# EAGLE design Zigbee Tracker v2 Mainboard (EAGLE 9.5.0)
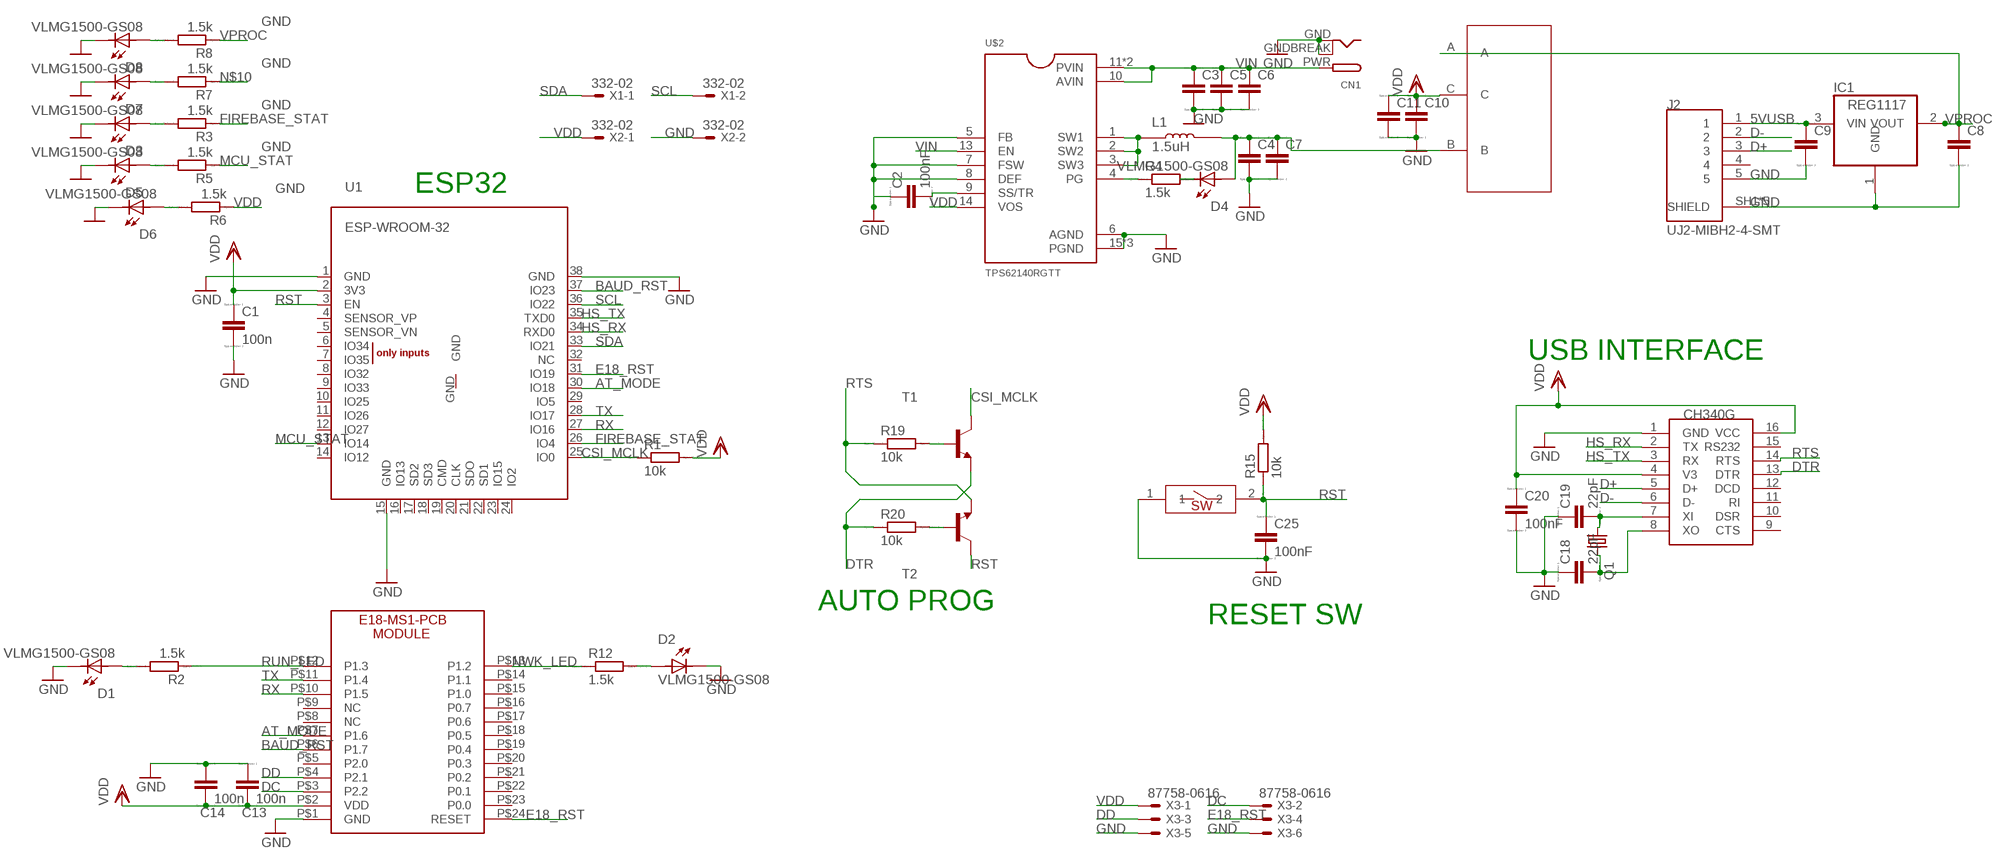
[diagram p0: schematic, sheet 1]

## Parts
C1  100n  CC0603  [C0603]
C2  100nF  CC0402  [C0402]
C3  CC0402  [C0402]
C4  CC0402  [C0402]
C5  CC1210  [C1210]
C6  CC1210  [C1210]
C7  CC1210  [C1210]
C8  CC0603  [C0603]
C9  CC0603  [C0603]
C10  CC1210  [C1210]
C11  CC1210  [C1210]
C13  100n  CC0603  [C0603]
C14  100n  CC0603  [C0603]
C18  22pF  CC0402  [C0402]
C19  22pF  CC0402  [C0402]
C20  100nF  CC0603  [C0603]
C25  100nF  CC0402  [C0402]
CN1  DCBARRELPTH  [DCJACK_2MM_PTH]
D1  VLMG1500-GS08  [LEDC1005X35N]
D2  VLMG1500-GS08  [LEDC1005X35N]
D3  VLMG1500-GS08  [LEDC1005X35N]
D4  VLMG1500-GS08  [LEDC1005X35N]
D5  VLMG1500-GS08  [LEDC1005X35N]
D6  VLMG1500-GS08  [LEDC1005X35N]
D7  VLMG1500-GS08  [LEDC1005X35N]
D8  VLMG1500-GS08  [LEDC1005X35N]
IC1  REG1117  [SOT223]
J2  UJ2-MIBH2-4-SMT  [CUI_UJ2-MIBH2-4-SMT]
L1  1.5uH  DFE252012F-100M=P2  [INDC2520X120N]
Q1  KX-7  [3.2X2.5_KX-7]
R1  10k  RR0402  [R0402]
R2  1.5k  RR0402  [R0402]
R3  1.5k  RR0402  [R0402]
R4  1.5k  RR0402  [R0402]
R5  1.5k  RR0402  [R0402]
R6  1.5k  RR0402  [R0402]
R7  1.5k  RR0402  [R0402]
R8  1.5k  RR0402  [R0402]
R12  1.5k  RR0402  [R0402]
R15  10k  RR0402  [R0402]
R19  10k  RR0402  [R0402]
R20  10k  RR0402  [R0402]
RESET  SMDSWITCH  [RESC4217X170]
T1  -NPN-SOT23-BEC  [SOT23-BEC]
T2  -NPN-SOT23-BEC  [SOT23-BEC]
U1  ESP-WROOM-32  [ESP-WROOM-32]
U5  H  CH340G  [SOIC16]
U$1  E18  [E18-MS1-PCB]
U$2  TPS62140RGTT  [QFN50P300X300X100-17N]
U$3  SMDTOGGLESWITCH  [SMDTOGGLESWITCH]
X1  332-02  [332-02]
X2  332-02  [332-02]
X3  87758-0616  [87758-0616]

## Nets
5VUSB [PWRINFL]: C9.1 IC1.3(VIN) J2.1
AT_MODE: U1.30(IO18) U$1.P$7(P1.6)
BAUD_RST: U1.37(IO23) U$1.P$6(P1.7)
CSI_MCLK: R1.1 T1.C U1.25(IO0)
D+: J2.3 U5.5(D+)
D-: J2.2 U5.6(D-)
DC: U$1.P$3(P2.2) X3.2
DD: U$1.P$4(P2.1) X3.3
DTR: R20.1 T1.E U5.13(DTR)
E18_RST: U1.31(IO19) U$1.P$24(RESET) X3.4
FIREBASE_STAT: R3.1 U1.26(IO4)
GND: C1.2 C2.1 C3.2 C4.2 C5.2 C6.2 C7.2 C8.2 C9.2 C10.2 C11.2 C13.1 C14.1 C18.1 C19.1 C20.2 C25.2 CN1.GND CN1.GNDBREAK D1.2 D2.2 D3.2 D5.2 D6.2 D7.2 D8.2 IC1.1(GND) J2.5 J2.SH1(SHIELD) J2.SH2(SHIELD) J2.SH3(SHIELD) J2.SH4(SHIELD) J2.SH5(SHIELD) RESET.1 U1.1(GND) U1.15(GND) U1.38(GND) U5.1(GND) U$1.P$1(GND) U$2.5(FB) U$2.6(AGND) U$2.7(FSW) U$2.8(DEF) U$2.15(PGND) U$2.16(PGND) U$2.TH(PGND) X2.2 X3.5 X3.6
HS_RX: U1.34(RXD0) U5.2(TX)
HS_TX: U1.35(TXD0) U5.3(RX)
MCU_STAT: R5.1 U1.13(IO14)
N$1: L1.1 U$2.1(SW1) U$2.2(SW2) U$2.3(SW3)
N$2: C2.2 U$2.9(SS/TR)
N$3: R19.2 T1.B
N$4: D1.1 R2.2
N$5: C18.2 Q1.3 U5.8(XO)
N$6: R20.2 T2.B
N$7: D3.1 R3.2
N$8: D4.2 R4.2
N$9: C19.2 Q1.1 U5.7(XI)
N$10: C4.1 C7.1 D4.1 L1.2 R7.1 U$3.B
N$11: D2.1 R12.2
N$12: R4.1 U$2.4(PG)
N$13: D5.1 R5.2
N$14: D6.1 R6.2
N$15: D7.1 R7.2
N$16: D8.1 R8.2
NWK_LED: R12.1 U$1.P$13(P1.2)
RST: C25.1 R15.1 RESET.2 T2.C U1.3(EN)
RTS: R19.1 T2.E U5.14(RTS)
RUN_LED: R2.1 U$1.P$12(P1.3)
RX: U1.27(IO16) U$1.P$10(P1.5)
SCL: U1.36(IO22) X1.2
SDA: U1.33(IO21) X1.1
TX: U1.28(IO17) U$1.P$11(P1.4)
VDD: C1.1 C10.1 C11.1 C13.2 C14.2 C20.1 R1.2 R6.1 R15.2 U1.2(3V3) U5.4(V3) U5.16(VCC) U$1.P$2(VDD) U$2.14(VOS) U$3.C X2.1 X3.1
VIN: C3.1 C5.1 C6.1 CN1.PWR U$2.10(AVIN) U$2.11(PVIN) U$2.12(PVIN) U$2.13(EN)
VPROC: C8.1 IC1.2(VOUT) R8.1 U$3.A
Unconnected: J2.4 U1.4(SENSOR_VP) U1.5(SENSOR_VN) U1.6(IO34) U1.7(IO35) U1.8(IO32) U1.9(IO33) U1.10(IO25) U1.11(IO26) U1.12(IO27) U1.14(IO12) U1.16(IO13) U1.17(SD2) U1.18(SD3) U1.19(CMD) U1.20(CLK) U1.21(SDO) U1.22(SD1) U1.23(IO15) U1.24(IO2) U1.29(IO5) U1.32(NC) U1.GND U5.9(CTS) U5.10(DSR) U5.11(RI) U5.12(DCD) U5.15(RS232) U$1.P$5(P2.0) U$1.P$8(NC) U$1.P$9(NC) U$1.P$14(P1.1) U$1.P$15(P1.0) U$1.P$16(P0.7) U$1.P$17(P0.6) U$1.P$18(P0.5) U$1.P$19(P0.4) U$1.P$20(P0.3) U$1.P$21(P0.2) U$1.P$22(P0.1) U$1.P$23(P0.0)

## Notes on the sheet
- ESP32
- USB INTERFACE
- AUTO PROG
- RESET SW

## Library data of the parts
C1-C11 C13 C14 C18-C20 C25 = eagle-ltspice:C: CAPACITOR, European symbol; SPICEMODEL: NONE; SPICEPREFIX: C
CN1 = adafruit:DCBARREL: 2.0mm DC Barrel Jack DCJACK_2MM_PTH - Through Hole Jack (4UConnector: 05537)
D1-D8 = VLMG1500-GS08:VLMG1500-GS08: 0402 GREEN 571nm 35MCD 65° Rectangle with Flat Top SMT LED; AVAILABILITY: Unavailable; DESCRIPTION: 0402 GREEN 571nm 35MCD 65° Rectangle with Flat Top SMT LED; MF: Vishay; MP: VLMG1500-GS08; PACKAGE: 0402 Vishay; PRICE: None
IC1 = burr-brown:REG1117: 800mA and 1A Low Dropout (LDO) Positive Regulator 1.8V, 2.5V, 2.85V, 3.3V, 5V, and Adj; MPN: REG1117; OC_FARNELL: 1097566; OC_NEWARK: 14P6981
J2 = UJ2-MIBH2-4-SMT:UJ2-MIBH2-4-SMT: Micro B, USB 2.0, 1.8 A, Right Angle, Surface Mount (SMT), USB Receptacle; AVAILABILITY: Unavailable; CUI_PURCHASE_URL: https://www.cui.com/product/interconnect/connectors/usb-connectors/uj2-mibh2-4-smt?utm_source=snapeda.com&utm_medium=referral&utm_campaign=snapedaBOM; DESCRIPTION: Micro B, USB 2.0, 1.8 A, Right Angle, Surface Mount _SMT_, USB Receptacle; MF: CUI Inc.; MP: UJ2-MIBH2-4-SMT; PACKAGE: None; PRICE: None
L1 = DFE252012F-100M_P2:DFE252012F-100M=P2: Inductor Power Chip Shielded Multi-Layer 10uH 20% 1MHz Metal 900mA 480mOhm DCR 1008 T/R; AVAILABILITY: Unavailable; DESCRIPTION: Inductor Power Chip Shielded Multi-Layer 10uH 20% 1MHz Metal 900mA 480mOhm DCR 1008 T/R; MF: Murata Electronics; MP: DFE252012F-100M=P2; PACKAGE: 1008 Murata; PRICE: None
Q1 = crystal-geyer_V1_0:KX: Quartz Crystals (MHz) SMD: KX - Serie Model Size l/w/h [mm] Frequency Range Frequency Stability Temp. Range [°C] Load Capacitance AECQ 200 availabel Datasheet KX-4 KX-5 KX-6 KX-7 KX-9A KX-9B KX-12A KX-12B KX-13 KX-20 KX-K KX-KS 1.6/1.2/0.3 2.0/1.6/0.45 2.5/2.0/0.55 3.2/2.5/0.8 5.0/3.2/1.0 5.0/3.2/1.1 6.0/3.5/1.1 6.0/3.5/1.0 7.0/5.0 /1.3 11.6/5.5/1.6 12.3/4.5/4.2 12.3/4.5/3.2 24.0 ~ 80.0 MHz 16.0 ~ 80.0 MHz 12.0 ~ 80.0 MHz 8.0 ~ 60.0 MHz 7,68 ~ 300,0 MHz 8,0 ~ 50,0 MHz 8,0 ~ 150,0 MHz 8,0 ~ 50,0 MHz 6,0 ~ 160,0 MHz 3,579 ~ 25,0 MHz 3,579 ~ 70,0 MHz 3,579 ~ 70,0 MHz ±10 … ±50ppm ±10 … ±50ppm ±10 … ±50ppm ±10 … ±50ppm ±10 … ±50ppm ±10 … ±50ppm ±10 … ±50ppm ±10 … ±50ppm ±10 … ±50ppm ±50ppm ±10 … ±50ppm ±10 … ±50ppm (*) -40°C …+85°C (*) -40°C …+125°C (*) -40°C …+125°C (*) -40°C …+125°C (*) -40°C …+105°C (*) -40°C …+105°C (*) -40°C …+125°C (*) -40°C …+105°C (*) -40°C …+105°C (*) -40°C …+105°C (*) -40°C …+85°C (*) -40°C …+85°C 8, 8…16 8, 8…16 10, 8…16 12, 7…20 16, 10…20 16, 10…20 16, 10…20 16, 12…20 16, 12…20 16, 12…20 16, 12…30 16, 12…30 - yes yes yes - - - - - - - - KX-4.pdf <http://www.geyer-electronic.de/uploads/tx_userartikelfrequenz/GEYER-KX-4.pdf> KX-5.pdf <http://www.geyer-electronic.de/uploads/tx_userartikelfrequenz/GEYER-KX-5.pdf> KX-6.pdf <http://www.geyer-electronic.de/uploads/tx_userartikelfrequenz/GEYER-KX-6.pdf> KX-7.pdf <http://www.geyer-electronic.de/uploads/tx_userartikelfrequenz/GEYER-KX-7.pdf> KX-9A.pdf <http://www.geyer-electronic.de/uploads/tx_userartikelfrequenz/GEYER-KX-9A.pdf> KX-9B.pdf <http://www.geyer-electronic.de/uploads/tx_userartikelfrequenz/GEYER-KX-9B.pdf> KX-12A.pdf <http://www.geyer-electronic.de/uploads/tx_userartikelfrequenz/GEYER-KX-12A.pdf> KX-12B.pdf <http://www.geyer-electronic.de/uploads/tx_userartikelfrequenz/GEYER-KX-12B.pdf> KX-13.pdf <http://www.geyer-electronic.de/uploads/tx_userartikelfrequenz/GEYER-KX-13.pdf> KX-20.pdf <http://www.geyer-electronic.de/uploads/tx_userartikelfrequenz/GEYER-KX-20.pdf> KX-K.pdf <http://www.geyer-electronic.de/uploads/tx_userartikelfrequenz/GEYER-KX-K.pdf> KX-KS.pdf <http://www.geyer-electronic.de/uploads/tx_userartikelfrequenz/GEYER-KX-KS.pdf> <http://www.geyer-electronic.de/fileadmin/template/img/logo-geyer-electronic.png> Details see: http://www.geyer-electronic.de/Frequenz-Produkte.9.0.html Created 2016-06-07, Hans Locher 2016 (C) Geyer Quartz Technology KX4,KX5,KX6,KX7,KX9A,KX9B,KX12A,KX12B,KX13,KX20,KXK,KXKS;1612;2016;2520;3225;5032;6035;7050;11655;12345;1,6x1,2;2,0x1,6;2,5x2,0;3,2x2,5;5,0x3,2;6,0x3,5;7,0x5,0;11,6x5,5;12,3x4,5;12,3x4,5;1.6x1.2;2.0x1.6;2.5x2.0;3.2x2.5;5.0x3.2;6.0x3.5;7.0x5.0;11.6x5.5;12.3x4.5;12.3x4.5;
R1-R8 R12 R15 R19 R20 = eagle-ltspice:R: RESISTOR, European symbol; SPICEMODEL: NONE; SPICEPREFIX: R
RESET = SMD SWITCH:SMDSWITCH
T1 T2 = DC_LOAD_AU:*-NPN-: NPN Transistror BF959 corrected 2008.03.06
U1 = esp32:ESP-WROOM-32
U5 = ch340g:CH340G
U$1 = E18:E18
U$2 = TPS62140RGTT:TPS62140RGTT: 3-V to 17-V 2-A Step-Down Converter in 3x3 QFN Package; AVAILABILITY: Unavailable; DESCRIPTION: 3?17V 2A Step-Down Converter with DCS-Control in 3x3 QFN package 16-QFN -40 to 85; MF: Texas Instruments; MP: TPS62140RGTT; PACKAGE: QFN-16 Texas Instruments; PRICE: None
U$3 = smdtoggleswitch:SMDTOGGLESWITCH
X1 X2 = con-garry:332-02: 2 Pin - 2mm Dual Row Source: www.mpe-connector.de / garry_shortform_2012.pdf
X3 = con-molex:87758-0616: 6 Pin - 2mm Dual Row Single Wafer, Vertical T/H HDR Source: http://www.molex.com/pdm_docs/sd/877580616_sd.pdf; MF: MOLEX; MPN: 87758-0616; OC_FARNELL: 7472323; OC_NEWARK: 25M5667

## Net classes
1 PWRINFL: width 0.381 mm, drill 0.305 mm, clearance 0.127 mm

## Board
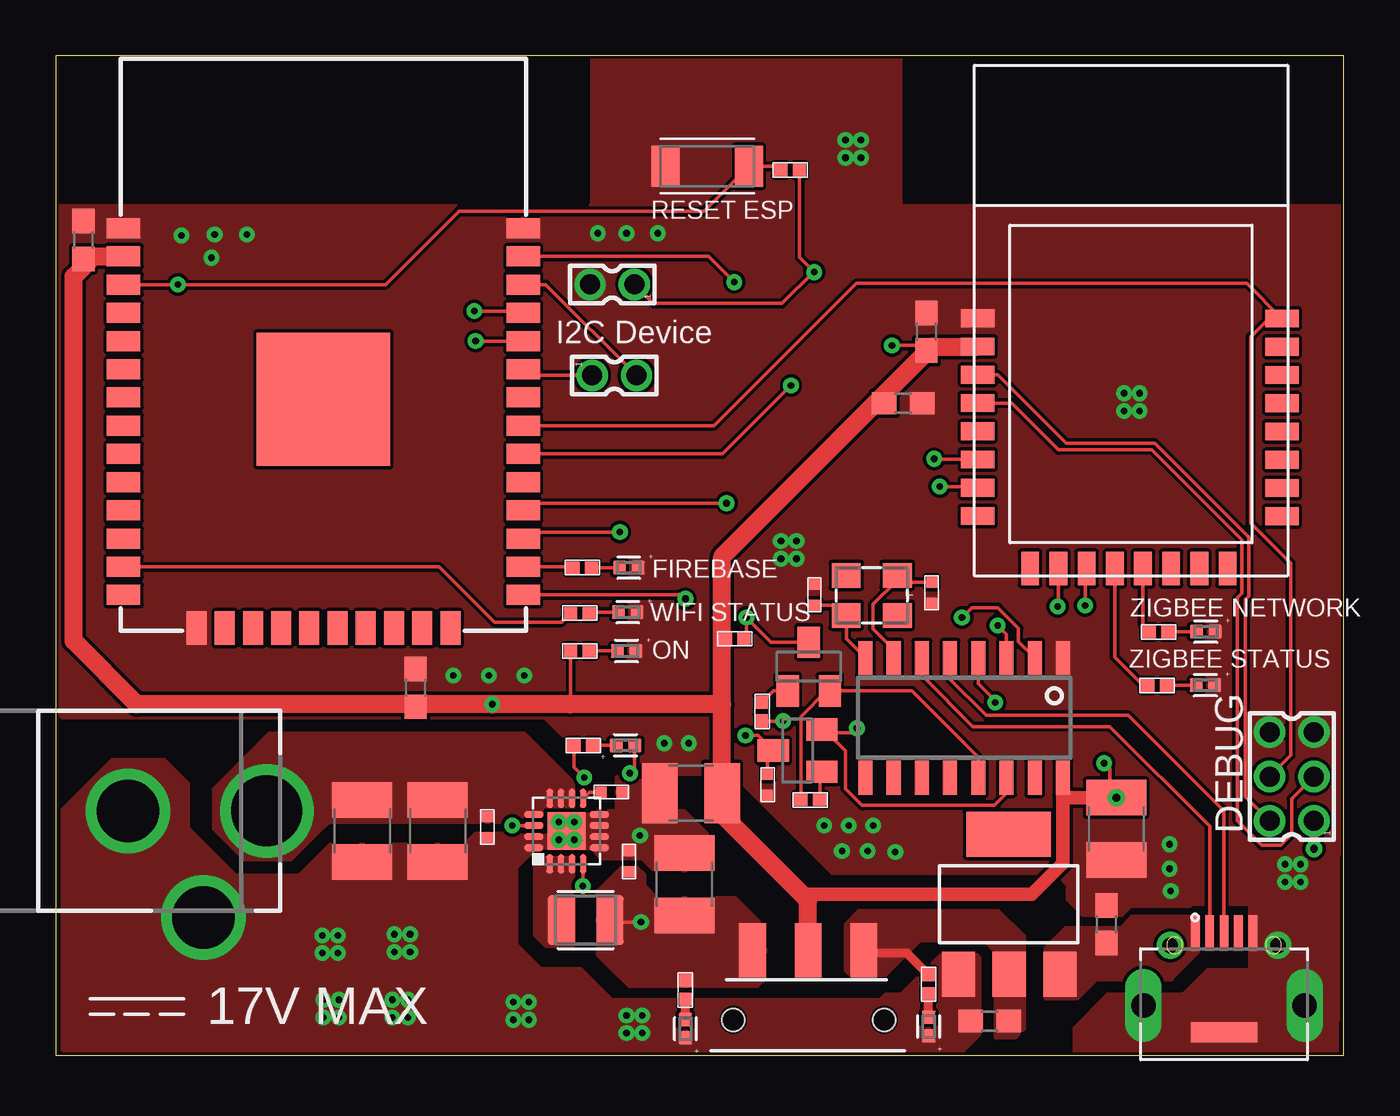
[diagram p1: board, top side]
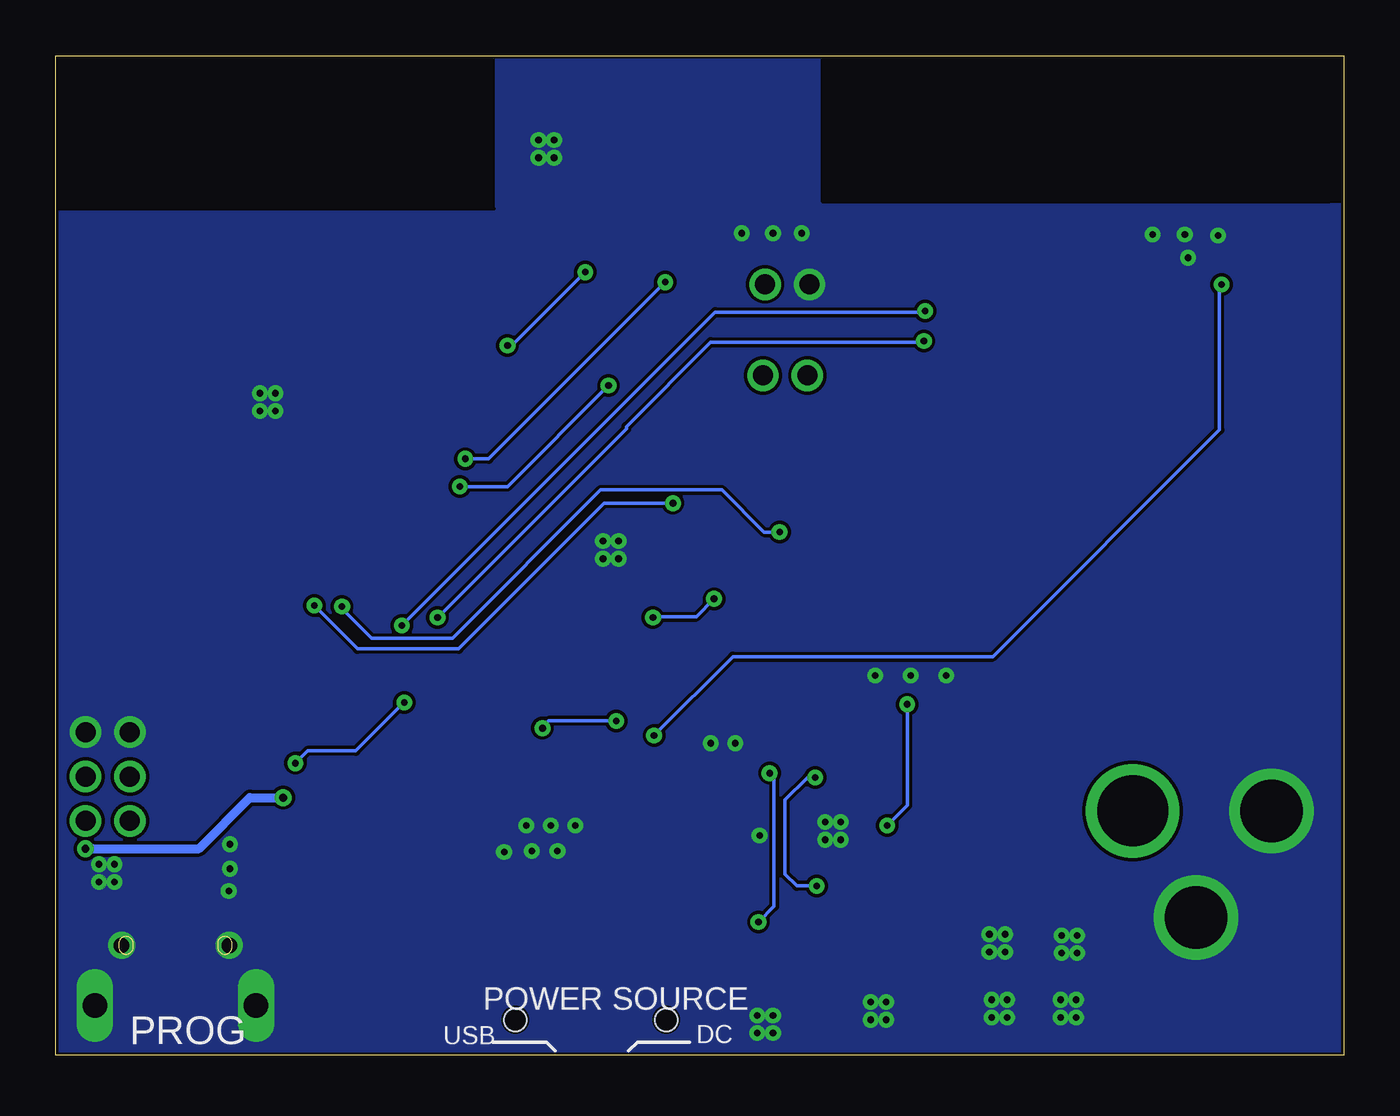
[diagram p2: board, bottom side, seen from below]

Size 58 x 45 mm. Coordinates in mm from the lower left corner, seen from the top.
Outline: 0,0 58,0 58,45 0,45 0,0
Copper layers (1*16): Top 0.035mm / dielectric 1.5mm / Bottom 0.035mm
Design rules "default *": minimum track width 5mil, minimum drill 0.3mm, track to track 6mil, track to pad 6mil, pad to pad 6mil, via to via 6mil, smd to smd 6mil, copper to edge 5mil, drill to drill 6mil, minimum pad ring 10mil, minimum via ring 8mil, stop-mask expansion 0mil, vias tented up to drill 40mil, thermal gap 0mil
bRestrict: area 38.2,38 to 58.2,45.4; area -0.1,38.5 to 0.8,45.2

### Footprints (pad centres in the part's own frame; a part is rotated, then mirrored left to right if it is on the bottom)
C0603 = smd 1.1 x 1: 1 -0.85,0; 2 0.85,0
C0402 = smd 0.5 x 0.5: 1 -0.475,0; 2 0.475,0
C1210 = smd 1.6 x 2.7: 1 -1.4,0; 2 1.4,0
DCJACK_2MM_PTH = drill 2.8: GND 0,7.35; GNDBREAK 4.8,10.75 | drill 3.2: PWR 0,13.6
LEDC1005X35N = smd 0.59 x 0.61: 1 -0.415,0; 2 0.415,0
SOT223 = smd 1.499 x 2.007: 1 -2.261,-3.15; 2 0.025,-3.15; 3 2.311,-3.15 | smd 3.81 x 2.007: 4 0,3.15
CUI_UJ2-MIBH2-4-SMT = smd 1.6 x 0.4: 1 1.1,0; 2 1.1,-0.65; 3 1.1,-1.3; 4 1.1,-1.95; 5 1.1,-2.6 | drill 1.1 pad 1.2 long: SH1 -2.15,2.325; SH4 -2.15,-4.925 | drill 0.7 pad 1: SH2 0.55,1.125; SH5 0.55,-3.725 | smd 0.9 x 3: SH3 -3.35,-1.3
INDC2520X120N = smd 1.24 x 2.22: 1 -1.09,0; 2 1.09,0
3.2X2.5_KX-7 = smd 1.3 x 1.1: 1 -1.15,-0.9; 2 1.15,-0.9; 3 1.15,0.9; 4 -1.15,0.9
R0402 = smd 0.6 x 0.55: 1 -0.425,0; 2 0.425,0
RESC4217X170 = smd 1.254 x 1.829: 1 -1.875,0; 2 1.875,0
SOT23-BEC = smd 1 x 1.4: B -0.95,-1.1; C 0,1.1; E 0.95,-1.1
ESP-WROOM-32 = smd 0.9 x 1.5: 1 7.7,9; 2 6.43,9; 3 5.16,9; 4 3.89,9; 5 2.62,9; 6 1.35,9; 7 0.08,9; 8 -1.19,9; 9 -2.46,9; 10 -3.73,9; 11 -5,9; 12 -6.27,9; 13 -7.54,9; 14 -8.81,9; 25 -8.81,-9; 26 -7.54,-9; 27 -6.27,-9; 28 -5,-9; 29 -3.73,-9; 30 -2.46,-9; 31 -1.19,-9; 32 0.08,-9; 33 1.35,-9; 34 2.62,-9; 35 3.89,-9; 36 5.16,-9; 37 6.43,-9; 38 7.7,-9 | smd 1.5 x 0.9: 15 -10.3,5.715; 16 -10.3,4.445; 17 -10.3,3.175; 18 -10.3,1.905; 19 -10.3,0.635; 20 -10.3,-0.635; 21 -10.3,-1.905; 22 -10.3,-3.175; 23 -10.3,-4.445; 24 -10.3,-5.715 | smd 6 x 6: GND 0,0
SOIC16 = smd 0.635 x 1.524: 1 -4.445,-2.695; 2 -3.175,-2.695; 3 -1.905,-2.695; 4 -0.635,-2.695; 5 0.635,-2.695; 6 1.905,-2.695; 7 3.175,-2.695; 8 4.445,-2.695; 9 4.445,2.695; 10 3.175,2.695; 11 1.905,2.695; 12 0.635,2.695; 13 -0.635,2.695; 14 -1.905,2.695; 15 -3.175,2.695; 16 -4.445,2.695
E18-MS1-PCB = smd 1.5 x 0.8: P$1 13.75,11.4; P$2 13.75,12.67; P$3 13.75,13.94; P$4 13.75,15.21; P$5 13.75,16.48; P$6 13.75,17.75; P$7 13.75,19.02; P$8 13.75,20.29; P$17 0.05,20.3; P$18 0.05,19.03; P$19 0.05,17.76; P$20 0.05,16.49; P$21 0.05,15.22; P$22 0.05,13.95; P$23 0.05,12.68; P$24 0.05,11.41 | smd 0.8 x 1.5: P$9 11.39,22.66; P$10 10.12,22.66; P$11 8.85,22.66; P$12 7.58,22.66; P$13 6.31,22.66; P$14 5.04,22.66; P$15 3.77,22.66; P$16 2.5,22.66
QFN50P300X300X100-17N = smd 0.85 x 0.3: 1 -1.482,0.757; 2 -1.482,0.257; 3 -1.482,-0.243; 4 -1.482,-0.743; 9 1.468,-0.743; 10 1.468,-0.243; 11 1.468,0.257; 12 1.468,0.757 | smd 0.3 x 0.85: 5 -0.757,-1.468; 6 -0.257,-1.468; 7 0.243,-1.468; 8 0.743,-1.468; 13 0.743,1.482; 14 0.243,1.482; 15 -0.257,1.482; 16 -0.757,1.482 | smd 1.7 x 1.7: TH -0.007,0.007
SMDTOGGLESWITCH = smd 2.45 x 1.2: A 1.37,3.77; B 1.37,-1.23; C 1.37,1.27 | hole 1: 4.5,4.7; 4.5,-2.1
332-02 = drill 0.9 pad 1.27: 1 0,-1; 2 0,1
87758-0616 = drill 0.9 pad 1.27: 1 -2,-1; 2 -2,1; 3 0,-1; 4 0,1; 5 2,-1; 6 2,1

### Placement (x,y rotation side)
C1  16.2,16.54 90 top
C2  25.02,11.85 180 top
C3  19.43,10.27 270 top
C4  25.81,8.73 90 top
C5  17.2,10.1 270 top
C6  13.8,10.1 270 top
C7  28.3,7.7 90 top
C8  42.05,1.55 180 top
C9  47.3,5.9 90 top
C10  47.75,10.2 270 top
C11  28.6,11.8 180 top
C13  38.15,29.35 180 top
C14  39.2,32.57 270 top
C18  34.16,20.73 270 top
C19  39.44,20.82 90 top
C20  1.25,36.7 90 top
C25  32.05,12.18 270 top
CN1  -4.1,11 270 top
D1  51.76,16.66 0 top
D2  51.78,19.07 0 top
D3  25.8,21.95 0 top
D4  25.65,13.95 180 top
D5  25.75,19.95 0 top
D6  25.7,18.2 0 top
D7  28.35,1.2 270 top
D8  39.3,1.3 270 top
IC1  42.9,6.8 0 top
J2  51.3,4.4 90 top
L1  23.86,6.09 0 top
Q1  36.74,20.7 180 top
R1  30.56,18.75 180 top
R2  49.59,16.65 0 top
R3  23.7,21.95 0 top
R4  23.75,13.95 0 top
R5  23.6,19.9 0 top
R6  23.6,18.2 0 top
R7  28.35,2.95 270 top
R8  39.3,3.2 270 top
R12  49.65,19.05 0 top
R15  33.06,39.85 0 top
R19  31.8,15.47 90 top
R20  33.97,11.5 0 top
RESET  29.33,40.02 0 top
T1  33.9,17.5 0 top
T2  33.4,13.72 90 top
U1  12.05,29.53 90 top
U5  40.9,15.19 180 top
U$1  55.26,44.57 180 top
U$2  23,10.1 90 top
U$3  32.6,6.1 270 top
X1  25.15,30.6 270 top
X2  25.05,34.7 90 top
X3  55.65,12.55 90 top

### Tracks (layer width: path | path; a pad name or v marks a point on that pad's centre or on a via)
5VUSB
  pour Top: 44.55,2.55 44.55,4.85 45.45,5.75 47.95,5.75 48.45,6.25 51.4,6.25 51.45,6.2 51.45,4.65 50.25,3.45 50.25,3.4 46.85,3.4 46,2.55
AT_MODE  (via drill 0.3)
  Top 0.152: U1.30 30.02,27.07 v33.1,30.15 | v39.8,25.6 41.46,25.6 U$1.P$7
  Bottom 0.152: v33.1,30.15 37.65,25.6 v39.8,25.6
BAUD_RST  (via drill 0.3)
  Top 0.152: U1.37 29.39,35.96 v30.55,34.8 | v39.55,26.85 39.58,26.82 U$1.P$6
  Bottom 0.152: v30.55,34.8 38.5,26.85 v39.55,26.85
CSI_MCLK  (via drill 0.3)
  Top 0.152: U1.25 28.02,20.72 28.05,20.75 28.15,20.75 v28.35,20.55 | R1.1 31.1,18.87 v31.1,19.7 32.2,18.6 T1.C
  Bottom 0.152: v28.35,20.55 29.15,19.75 31.05,19.75 v31.1,19.7
D+
  Top 0.152: J2.3 52.6,11 48.3,15.3 41.9,15.3 40.27,16.94 U5.5
D-
  Top 0.152: J2.2 51.95,10.3 47.45,14.8 41.3,14.8 38.99,17.11 U5.6
DC
  Top 0.152: X3.2 53.55,11.65 53.55,20.52 53.7,20.67 53.7,23.33 49.48,27.55 45.49,27.55 42.42,30.63 U$1.P$3
DD
  Top 0.152: X3.3 55.65,11.55 55.65,9.95 55.15,9.45 54.3,9.45 53.2,10.55 53.2,20.6 53.4,20.8 53.4,23.2 49.35,27.25 45.15,27.25 43.04,29.36 U$1.P$4
DTR
  Top 0.152: R20.1 33.55,15.24 34.71,16.4 T1.E 38.55,16.4 41.53,13.41 U5.13
E18_RST
  Top 0.152: U1.31 29.64,28.34 36.05,34.75 53.62,34.75 U$1.P$24 54.61,33.16 53.8,32.35 53.8,23.95 55.6,22.15 55.6,13.5 X3.4
FIREBASE_STAT
  Top 0.152: U1.26 23.23,21.99 R3.1
GND  (via drill 0.3)
  other vias: 23.35,9.7 22.65,9.7 23.35,10.5 22.65,10.5 33.35,22.35 32.65,22.35 33.35,23.15 32.65,23.15 48.8,29 48.1,29 48.8,29.8 48.1,29.8 56.05,7.8 55.35,7.8 56.05,8.6 55.35,8.6 26.4,1 25.7,1 26.4,1.8 25.7,1.8 21.3,1.6 20.6,1.6 21.3,2.4 20.6,2.4 15.85,1.7 15.15,1.7 15.85,2.5 15.15,2.5 12.75,1.7 12.05,1.7 12.75,2.5 12.05,2.5 15.95,4.65 15.25,4.65 15.95,5.45 15.25,5.45 12.7,4.6 12,4.6 12.7,5.4 12,5.4 26.3,9.9 50.15,9.5 50.15,8.4 50.2,7.4 28.5,14.05 27.4,14.05 21.1,17.1 19.5,17.1 17.9,17.1 5.65,36.9 7.15,36.95 8.6,36.95 7,35.9 27.1,37 25.7,37 24.4,37 36.25,40.4 35.55,40.4 36.25,41.2 35.55,41.2 34.6,10.35 35.7,10.35 36.8,10.35 37.8,9.15 36.55,9.2 35.4,9.2
  pour Top: 41.6,0.95 41.6,4.4 41.4,4.6 39.9,4.6 38.9,3.6 38.05,2.75 37.35,2.75 37.1,2.5 28.95,2.5 25.05,2.5 23.65,3.9 21.85,3.9 20.75,5 20.75,8.45 21.3,9 21.55,9.25 21.85,9.25 21.85,9.9 20.65,9.9 20.4,9.9 20.3,10 18.9,10 18.7,9.8 18.4,9.5 12.35,9.5 10.95,8.1 9.35,8.1 8.1,8.1 6.55,9.65 5.95,10.25 5.95,12.25 4.9,13.3 2.55,13.3 0.3,11.05 0.3,9 0.3,0.25 0.45,0.1 40.75,0.1
  pour Top: 21.85,9.9 22.25,9.9 22.25,9.35 21.9,9.35 21.85,9.3
  pour Top: 29.55,8.3 29.55,9.75 29.45,9.85 28.3,11 24.15,11 24.15,9.25 24.2,9.2 24.55,8.85 26.4,8.85 26.9,8.35 27.15,8.35 27.2,8.3
  pour Top: 24.35,9.3 23.7,9.3 23.65,9.35 23.65,10.8 23.7,10.85 24.35,10.85
  pour Top: 46.9,6.3 46.25,6.3 45.55,7 45.55,7.55 46.3,8.3 46.3,9.35 46.45,9.5 49.7,9.5 51.3,7.9 51.3,6.95 51.05,6.7 48.4,6.7 48,6.3 47.65,6.3
  pour Top: 0.3,15.2 22,15.2 24.55,12.65 30.5,12.65 34.95,8.2 45,8.2 46.4,6.8 55.55,6.8 57.85,9.1 57.85,38.25 0.1,38.25 0.1,15.4
  pour Top: 22.6,36.8 24.15,38.35 24.15,44.95 38.05,44.95 38.05,36.8
  pour Top: 25.25,10.8 25.25,12.55 26.35,12.55 26.35,10.8
  pour Top: 45.85,0.15 45.85,1.25 47.35,2.75 50.75,2.75 51.85,3.85 53.75,3.85 53.75,7 55.75,9 57.75,9 57.75,1.6 57.7,1.55 57.7,0.2 57.55,0.05 45.95,0.05
  pour Bottom: 0.1,45.45 57.9,45.45 58.75,44.6 58.75,0.3 57.6,-0.85 0.7,-0.85 -0.4,0.25 -0.4,44.95
HS_RX  (via drill 0.3)
  Top 0.152: U5.2 43.35,18.61 43.35,19.22 42.42,20.15 41.25,20.15 v40.8,19.7 | v18.9,32.15 U1.34
  Bottom 0.152: v40.8,19.7 32.3,28.2 32.3,28.3 28.5,32.1 18.95,32.1 v18.9,32.15
HS_TX  (via drill 0.3)
  Top 0.152: U5.3 42.8,18.95 v42.4,19.35 | v18.85,33.5 20.97,33.5 U1.35
  Bottom 0.152: v42.4,19.35 28.3,33.45 18.9,33.45 v18.85,33.5
MCU_STAT
  Top 0.152: U1.13 17.26,21.99 19.75,19.5 22.77,19.5 R5.1
N$1
  pour Top: 23.3,4.9 23.3,8.9 21.85,8.9 21.55,8.6 21.55,5.4 22.05,4.9
N$2
  Top 0.152: U$2.9 24.02,11.85 C2.2
N$3
  Top 0.152: T1.B 32.3,16.4 R19.2
N$4
  Top 0.152: R2.2 D1.1
N$5
  Top 0.152: U5.8 35.59,18.75 Q1.3 35.13,20.25 C18.2
N$6
  Top 0.152: R20.2 34.4,12.66 T2.B
N$7
  Top 0.152: D3.1 R3.2
N$8
  Top 0.152: R4.2 D4.2
N$9
  Top 0.152: U5.7 37.73,18.27 36.8,19.2 36.8,20.3 37.89,21.39 Q1.1 38.2,21.3 C19.2
N$10  (via drill 0.3)
  Top 0.152: D4.1 26.07,12.91 v25.85,12.7 | v26.35,6 25.04,6 L1.2
  Bottom 0.152: v26.35,6 25.65,6.7 25.65,12.5 v25.85,12.7
  pour Top: 31.95,3.45 31.95,5.75 30.65,7.05 30.6,7.1 27.05,7.1 26.5,7.65 26.5,8.15 26.2,8.45 25.75,8.45 25.45,8.45 24.55,7.55 24.4,7.4 24.4,5.8 24.4,4.5 24.95,3.95 25.8,3.1 31.6,3.1
N$11
  Top 0.152: D2.1 50.09,19.07 R12.2
N$12  (via drill 0.3)
  Top 0.152: U$2.4 23.74,7.64 v23.73,7.62 | v23.8,12.5 23.32,12.97 R4.1
  Bottom 0.152: v23.73,7.62 24.62,7.62 25.15,8.15 25.15,11.5 24.15,12.5 v23.8,12.5
N$13
  Top 0.152: D5.1 24.07,19.95 R5.2
N$14
  Top 0.152: D6.1 R6.2
N$15
  Top 0.406: D7.1 R7.2
N$16
  Top 0.406: D8.1 R8.2
NWK_LED
  Top 0.152: R12.1 48.95,19.32 U$1.P$13
RST  (via drill 0.3)
  Top 0.152: C25.1 32.05,13.47 T2.C 31.62,14.4 v31.05,14.4 | U1.3 v5.5,34.69 14.84,34.69 18.15,38 29.18,38 RESET.2 32.47,40.02 R15.1
  Bottom 0.152: v31.05,14.4 27.5,17.95 15.8,17.95 5.6,28.15 5.6,34.59 v5.5,34.69
RTS  (via drill 0.3)
  Top 0.152: U5.14 42.7,12.39 42.7,11.7 42.25,11.25 36.3,11.25 35.91,11.64 35.55,12 35.55,13.7 34.73,14.53 | 34.73,14.53 34.58,14.67 T2.E | R19.1 v32.74,15.04 v32.75,15.05 | v36.08,14.72 35.88,14.53 34.73,14.53
  Bottom 0.152: v32.75,15.05 35.8,15.05 36.1,14.75 v36.08,14.72
RUN_LED
  Top 0.152: U$1.P$12 47.68,17.92 48.95,16.65 R2.1
RX  (via drill 0.3)
  Top 0.152: U$1.P$10 45.14,20.24 v45.1,20.2 | v25.4,23.55 21.34,23.55 U1.27
  Bottom 0.152: v45.1,20.2 45.1,20.1 43.77,18.77 40.13,18.77 33.45,25.45 28,25.45 26.1,23.55 v25.4,23.55
SCL
  Top 0.152: U1.36 22.06,34.69 X1.2
SDA
  Top 0.152: X1.1 21.33,30.6 U1.33
TX  (via drill 0.3)
  Top 0.152: U1.28 21.37,24.85 v30.2,24.85 | v46.35,20.25 46.35,21.85 U$1.P$11
  Bottom 0.152: v30.2,24.85 33.3,24.85 39.85,18.3 44.4,18.3 v46.35,20.25
VDD  (via drill 0.3, 0.35)
  Top 0.152: C20.1 2.83,36.18 U1.2 | C14.2 39.25,32.09 | 39.25,32.09 41.31,32.09 U$1.P$2 | R6.1 23.18,15.8 | R15.2 33.48,35.91 34.12,35.27 | 34.12,35.27 v34.15,35.25 | v37.65,31.95 39.1,31.95 39.25,32.09 | U$2.14 v20.56,10.34 v20.55,10.35 | X2.1 26.9,33.85 32.7,33.85 34.12,35.27 | 16.45,15.8 16.29,15.8 C1.1 | C13.2 38.3,30.75 39.45,31.9 | U5.4 41.53,16.71 42.3,15.95 v42.3,15.88 | v47.2,13.15 47.45,12.9 47.45,11.6 | R1.2 30.14,11.93 C11.1
  Top 0.406: X3.1 v56.65,9.3
  Top 0.61: 33.6,7.25 43.95,7.25 45.34,8.64 45.34,11.65 | 45.34,11.65 U5.16 | C10.1 47.45,11.6 45.4,11.6 45.34,11.65
  Top 0.813: U$3.C 33.87,6.98 33.6,7.25 30,10.85 C11.1 30,15.8 | U$1.P$2 39.45,31.9 30,22.45 30,15.8 | 30,15.8 23.18,15.8 v19.65,15.8 16.45,15.8 3.65,15.8 0.8,18.65 0.8,35.05 1.71,35.96 U1.2
  Bottom 0.152: v34.15,35.25 37.45,31.95 v37.65,31.95 | v20.55,10.35 19.65,11.25 v19.65,15.8 | v42.3,15.88 44.48,13.7 46.65,13.7 v47.2,13.15
  Bottom 0.406: v56.65,9.3 56.35,9.3 56.34,9.31 51.54,9.31 49.25,11.6 C10.1
  other vias: 47.75,11.6
VIN
  pour Top: 10.2,8.8 8.5,8.8 7.3,10 7.1,10.2 7.1,12 9.6,14.5 13,14.5 21.1,14.5 23.3,12.3 23.3,11.2 22,11.2 21.9,11.1 21.9,10.8 21.1,10.8 20.8,10.5 19.3,10.5 12.3,10.5 11.9,10.1 10.6,8.8
VPROC
  Top 0.406: R8.1 38.33,4.6 36.5,4.6 U$3.A
  pour Top: 42.3,0.8 42.3,4.65 41.8,5.15 38.9,5.15 38.6,4.85 37.35,3.6 36,3.6 35.75,3.6 35.7,3.65 35.55,3.8 35.55,5.9 36.15,6.5 42.45,6.5 43.6,5.35 43.6,4.35 43.6,1.2 43.2,0.8 42.35,0.8

### Text on the board
tPlace: RESET ESP | I2C Device | FIREBASE | WIFI STATUS | ZIGBEE NETWORK | ON | ZIGBEE STATUS | DEBUG | 17V MAX
bPlace: POWER SOURCE | DC | USB | PROG